# Altium schematic sheet Light interrupter.SchDoc
size A4
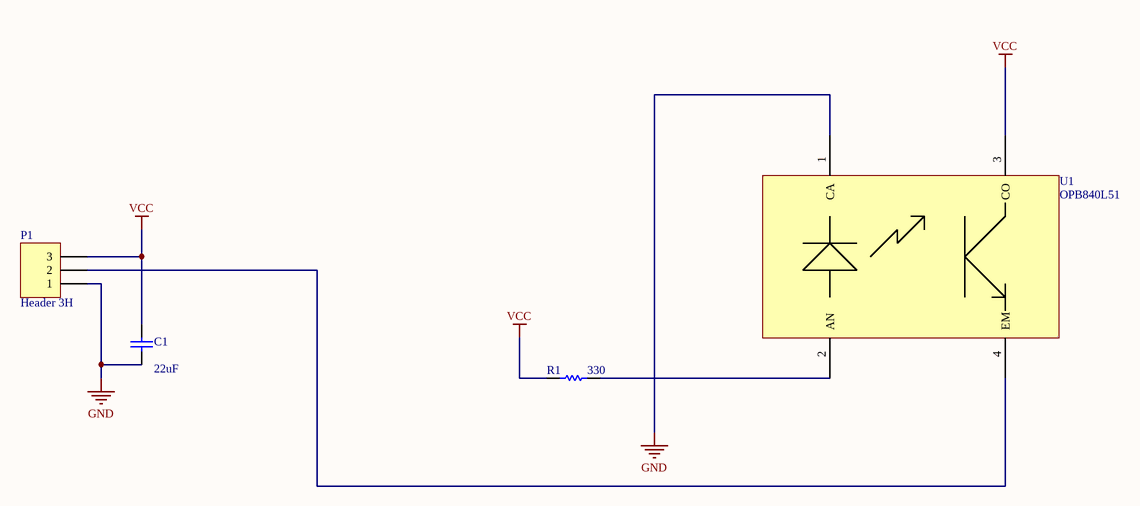
[diagram p0: Light interrupter.SchDoc]

## Parts
C1  value 22uF  [1608[0603]]
P1  Header 3H  [HDR1X3H]
R1  value 330  [1608[0603]]
U1  OPB840L51  [OPB840L51_Housing]

## Nets
GND: C1.1 P1.1 U1.1(CA)
VCC: C1.2 P1.3 R1.1 U1.3(CO)
NetP1_2: P1.2 U1.4(EM)
NetR1_2: R1.2 U1.2(AN)

## Library data of the parts
C1 = Cap: Capacitor; Published: 8-Jun-2000; LatestRevisionDate: 17-Jul-2002; LatestRevisionNote: Re-released for DXP Platform.; PackageReference: RAD-0.3; Publisher: Altium Limited; PackageDescription: Radial Cap, Thru-Hole; 2 Leads; 0.3 in Pin Spacing
P1 = Header 3H: Header, 3-Pin, Right Angle; LatestRevisionDate: 17-Jul-2002; LatestRevisionNote: Re-released for DXP Platform.; Publisher: Altium Limited
R1 = Res Semi: Semiconductor Resistor; Published: 8-Jun-2000; LatestRevisionDate: 17-Jul-2002; LatestRevisionNote: Re-released for DXP Platform.; PackageReference: AXIAL-0.5; Publisher: Altium Limited; PackageDescription: Axial Device, Thru-Hole; 2 Leads; 0.5 in Pin Spacing
U1 = OPB840L51: Slotted Optical Switch, TT electronics